# Altium schematic sheet Sheet1.SchDoc
size A4; SheetNumber: 1; SheetTotal: 1
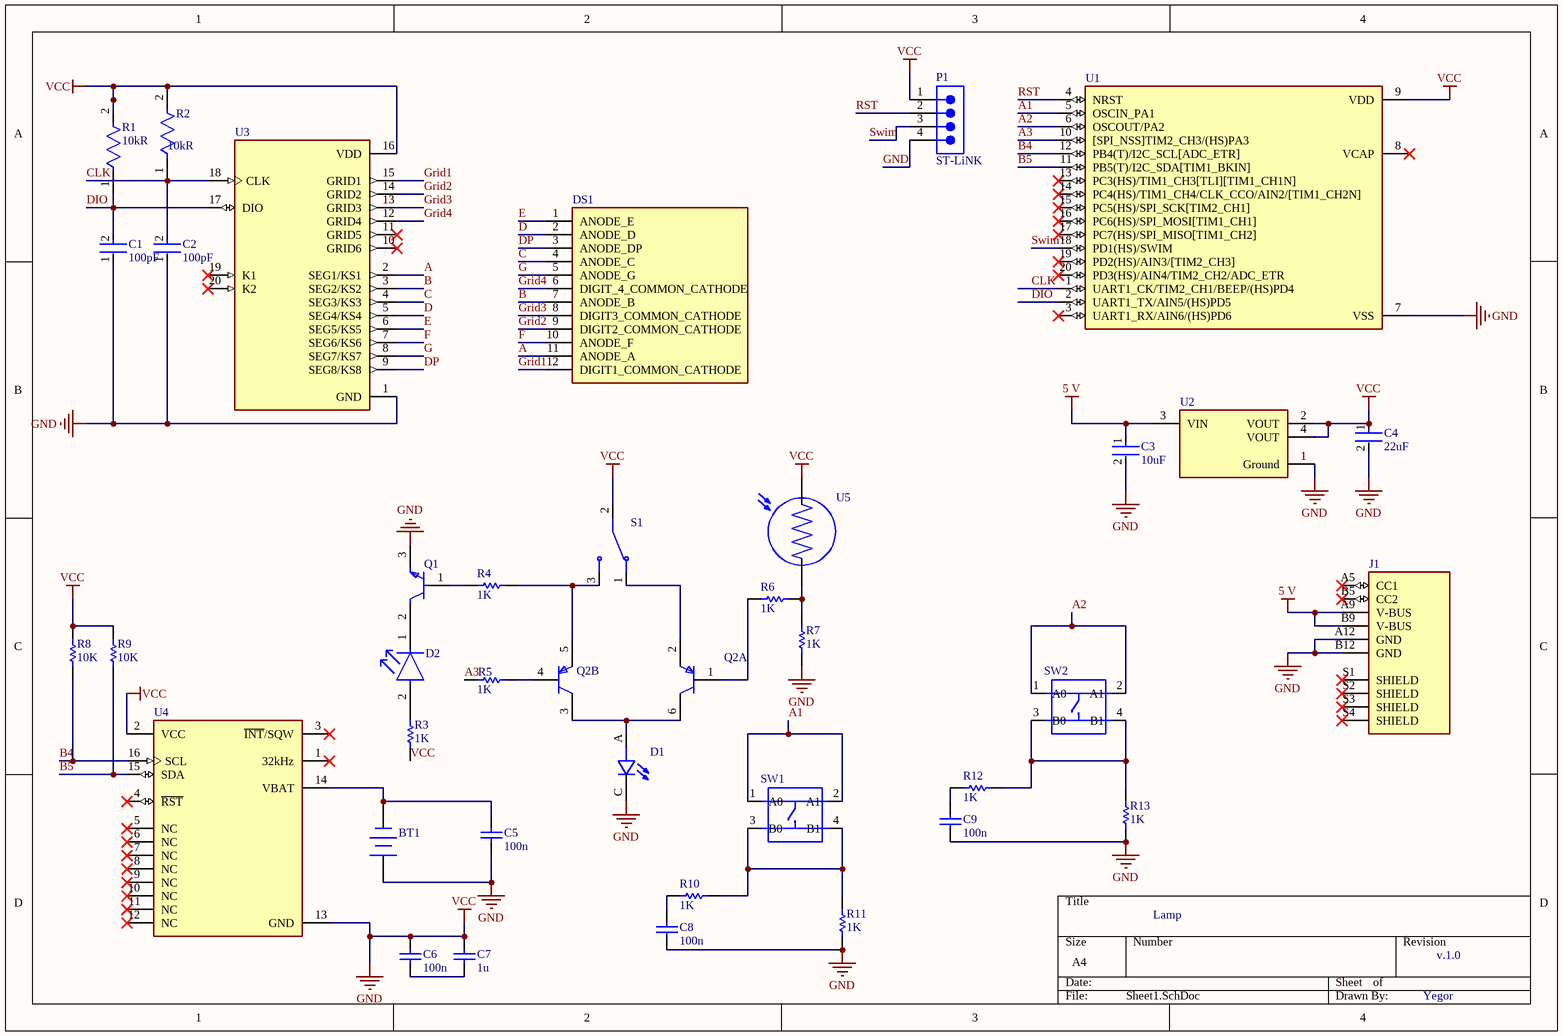
[diagram p0: Sheet1.SchDoc]

## Parts
BT1  (no value)  [PANA-CR-2032HFN]
C1  100pF  [FP-C1608-080-0_1-MFG]
C2  100pF  [FP-C1608-080-0_1-MFG]
C3  10uF  [FP-CL21-IPC_A]
C4  22uF  [FP-CL32-IPC_A]
C5  value 100n  (hidden comment: Capacitor)
C6  value 100n  (hidden comment: Capacitor)
C7  value 1u  (hidden comment: Capacitor)
C8  value 100n  (hidden comment: Capacitor)
C9  value 100n  (hidden comment: Capacitor)
D1  (no value)  [LEDC1608X65N]
D2  (no value)  [FP-6_541-5092_01-4-MFG]
DS1  (no value)  [AVAGO_HDSP-B09G]
J1  (no value)  [CUI_UJC-HP-3-SMT-TR]
P1  ST-LiNK  [61300411021]
Q1  (no value)  [PLZZ0004CA-A_MFG]
Q2  (no value)  [SOT95P280X145-6_P6_064_N]  (parts A,B of 2)
R1  10kR  [FP-CRCW1206-e3-IPC_B]
R2  10kR  [FP-CRCW1206-e3-IPC_B]
R3  value 1K  (hidden comment: Resistor)
R4  value 1K  (hidden comment: Resistor)
R5  value 1K  (hidden comment: Resistor)
R6  value 1K  (hidden comment: Resistor)
R7  value 1K  (hidden comment: Resistor)
R8  value 10K  (hidden comment: Resistor)
R9  value 10K  (hidden comment: Resistor)
R10  value 1K  (hidden comment: Resistor)
R11  value 1K  (hidden comment: Resistor)
R12  value 1K  (hidden comment: Resistor)
R13  value 1K  (hidden comment: Resistor)
S1  (no value)  [SW_MINI-SPDT-SW]
SW1  (no value)  [SW4-SMD-5.2X5.2X1.5MM]
SW2  (no value)  [SW4-SMD-5.2X5.2X1.5MM]
U1  (no value)  [SOP65P640X120-20N]
U2  (no value)  [FP-AMS1117-IPC_A]
U3  (no value)  [DIP778W43P254L2612H431Q20N]
U4  (no value)  [FP-W16-H2-MFG]
U5  (no value)  [XDCR_PDV-P8003]

## Nets
5 V: C3.1 J1.A9(V-BUS) J1.B9(V-BUS) U2.3(VIN)
GND: BT1.1(+) C1.1 C2.1 C3.2 C4.1 C4.2 C5.1 C6.2 C7.2 C8.1 C9.1 D1.C J1.A12(GND) J1.B12(GND) P1.1 P1.4 Q1.3(EMITTER) R1.2 R2.2 R3.1 R7.1 R8.2 R9.2 R11.1 R13.1 S1.2 U1.7(VSS) U1.9(VDD) U2.1(Ground) U2.2(VOUT) U2.4(VOUT) U3.1(GND) U3.16(VDD) U4.2(VCC) U4.13(GND) U5.2  [also labelled VCC]
A: DS1.11(ANODE_A) U3.2(SEG1/KS1)
A1: SW1.1(A0) SW1.2(A1) U1.5(OSCIN_PA1)
A2: SW2.1(A0) SW2.2(A1) U1.6(OSCOUT/PA2)
A3: R5.2 U1.10([SPI_NSS]TIM2_CH3/(HS)PA3)
B: DS1.7(ANODE_B) U3.3(SEG2/KS2)
B4: R8.1 U1.12(PB4(T)/I2C_SCL[ADC_ETR]) U4.16(SCL)
B5: R9.1 U1.11(PB5(T)/I2C_SDA[TIM1_BKIN]) U4.15(SDA)
C: DS1.4(ANODE_C) U3.4(SEG3/KS3)
CLK: C2.2 R2.1 U1.1(UART1_CK/TIM2_CH1/BEEP/(HS)PD4) U3.18(CLK)
D: DS1.2(ANODE_D) U3.5(SEG4/KS4)
DIO: C1.2 R1.1 U1.2(UART1_TX/AIN5/(HS)PD5) U3.17(DIO)
DP: DS1.3(ANODE_DP) U3.9(SEG8/KS8)
E: DS1.1(ANODE_E) U3.6(SEG5/KS5)
F: DS1.10(ANODE_F) U3.7(SEG6/KS6)
G: DS1.5(ANODE_G) U3.8(SEG7/KS7)
Grid1: DS1.12(DIGIT1_COMMON_CATHODE) U3.15(GRID1)
Grid2: DS1.9(DIGIT2_COMMON_CATHODE) U3.14(GRID2)
Grid3: DS1.8(DIGIT3_COMMON_CATHODE) U3.13(GRID3)
Grid4: DS1.6(DIGIT_4_COMMON_CATHODE) U3.12(GRID4)
RST: P1.2 U1.4(NRST)
Swim: P1.3 U1.18(PD1(HS)/SWIM)
NetBT1_2: BT1.2(-) C5.2 U4.14(VBAT)
NetC6_1: C6.1 C7.1
NetC8_2: C8.2 R10.1
NetC9_2: C9.2 R12.1
NetD1_A: D1.A Q2.3(2_COLLECTOR) Q2.6(1_COLLECTOR)
NetD2_1: D2.1(C) Q1.2(COLLECTOR)
NetD2_2: D2.2(A) R3.2
NetQ1_1: Q1.1(BASE) R4.1
NetQ2_1: Q2.1(1_BASE) R6.1
NetQ2_2: Q2.2(1_EMITTER) S1.1
NetQ2_4: Q2.4(2_BASE) R5.1
NetQ2_5: Q2.5(2_EMITTER) R4.2 S1.3
NetR6_2: R6.2 R7.2 U5.1
NetR10_2: R10.2 R11.2 SW1.3(B0) SW1.4(B1)
NetR12_2: R12.2 R13.2 SW2.3(B0) SW2.4(B1)

Not connected (* = marked no-connect by the designer): J1 A5(CC1)* B5(CC2)* S1(SHIELD)* S2(SHIELD)* S3(SHIELD)* S4(SHIELD)*; U1 3(UART1_RX/AIN6/(HS)PD6)* 8(VCAP)* 13(PC3(HS)/TIM1_CH3[TLI][TIM1_CH1N])* 14(PC4(HS)/TIM1_CH4/CLK_CCO/AIN2/[TIM1_CH2N])* 15(PC5(HS)/SPI_SCK[TIM2_CH1])* 16(PC6(HS)/SPI_MOSI[TIM1_CH1])* 17(PC7(HS)/SPI_MISO[TIM1_CH2])* 19(PD2(HS)/AIN3/[TIM2_CH3])* 20(PD3(HS)/AIN4/TIM2_CH2/ADC_ETR)*; U3 10(GRID6)* 11(GRID5)* 19(K1)* 20(K2)*; U4 1(32kHz)* 3(~{INT}/SQW)* 4(~{RST})* 5(NC)* 6(NC)* 7(NC)* 8(NC)* 9(NC)* 10(NC)* 11(NC)* 12(NC)*

## Notes on the sheet
- Lamp
- v.1.0
- Yegor

## Library data of the parts
BT1 = CMP-2000-05296-1: Coin Cell Battery, 225 mAh, 0.2 mA, 3 V, -30 to 60 degC, Bulk; Manufacturer: Panasonic; SVHC: 1,2-dimethoxyethane,ethyleneglycoldimethylether(EGDME)(15-Jun-2015); Battery Size Code: 2032; Battery Voltage: 3V; Battery IEC Code: CR2032; Battery NEDA Code: 5004LC; External Height: 3.2mm; Battery Terminals: PCBPins; Battery Capacity: 220mAh; External Diameter: 20mm; Battery Technology: LithiumManganeseDioxide; Product Range: -; Datasheet Version: Rev. 0, 05/2010; Manufacturer URL: http://www.panasonic.com/; External Depth: -; Weight: 2.9g; Datasheet URL: https://datasheet.ciiva.com/3/aaa4000de87-3072.pdf; External Width: -
C1 C2 = CMP-08246-002637-1: Multilayer Ceramic Capacitors 100pF ±5% 50V C0G SMD 0603; Temperature Coefficient: 30ppm/°C; Dielectric Material: Ceramic; Width: 0.031inch; Case/Package: 0603; Package Quantity: 1; REACH SVHC: No SVHC; Depth: 0.8mm; Height: 0.8mm; Thickness: 0.037inch; Capacitance: 100pF; Min Operating Temperature: -55°C; Packaging: Tape and Reel; Case Code (Metric): 1608; Lead Free: Lead Free; Length: 1.6mm; Voltage: 50V; Dielectric: C0G; Tolerance: 5%; Weight: 7.1E-05oz; Voltage Rating (DC): 50V; Mount: Surface Mount; Termination: SMD/SMT; Voltage Rating: 50V; Series: C; Radiation Hardening: No; Number of Pins: 2; Max Operating Temperature: 125°C; Construction: Flat; RoHS Compliant: Yes; Case Code (Imperial): 0603
C3 = CMP-13271-002245-1: CL21 Series 0805 10uF 10V ±20% Tolerance X5R Multilayer Ceramic Chip Capacitor; Voltage Rating (DC): 10V; Mount: Surface Mount; Tolerance: 20%; Case/Package: 0805; Voltage Rating: 10V; Dielectric: X5R; Max Operating Temperature: 85°C; Packaging: Tape and Reel; Capacitance: 10uF; Height: 1.25mm; Thickness: 0.053inch; Width: 0.049inch; Length: 2mm; Radiation Hardening: No; Min Operating Temperature: -55°C; Depth: 1.25mm; Package Quantity: 10000
C4 = CMP-13271-001877-1: Cap Ceramic 22uF 6.3V X7R ±20% SMD 1210 +125°C Embossed T/R; Radiation Hardening: No; Case Code (Metric): 3225; Tolerance: 20%; Dielectric: X7R; Voltage Rating (DC): 6.3V; Package Quantity: 1; Lead Free: Lead Free; Max Operating Temperature: 125°C; Height: 2.5mm; Thickness: 0.106inch; Case Code (Imperial): 1210; Voltage Rating: 6.3V; Packaging: Tape and Reel; Capacitance: 22uF; Length: 3.2mm; Min Operating Temperature: -55°C; Depth: 2.5mm; Case/Package: 1210; Width: 0.098inch; Mount: Surface Mount
C5-C9 = Capacitor: SimulationGenericComponent: True
D1 = LTW-C191TLA: CHIP LED WHITE 0603 TOP VIEW; Package: None; Availability: Unavailable; MP: LTW-C191TLA; Value: *; Price: None
D2 = CMP-02520-000012-1: LED RED 0603 SMD; Manufacturer: Vishay; Manufacturer Part Number: VLMS1300-GS08; Forward Voltage: 2V; Reverse Voltage: 5V; Power Dissipation: 75mW; Forward Current: 20mA; Luminous Intensity: 54mcd; Led Orientation: Top View; Peak Emmision Wavelength: 639nm; Viewing Angle: 130°; Wavelength: 631nm; Digikey Description: LED RED 0603 SMD; Height: 1mm; Colour: Red; Ambient Temperature Range High: +85°C; Ambient Temperature Range Low: -35°C; Package: 6.541-5092.01-4; Automotive: No; Temperature Range High: +85°C; Device Class L3: unset; Lead Free: Yes; Temperature Range Low: -35°C; Temperature: -35°C to +85°C; Device Class L2: LEDs; ComponentLink2Description: Datasheet; Octopart: https://octopart.com/vlms1300-gs08-vishay-21709201; Device Class L1: Optoelectronics; RoHS: TRUE; ComponentLink2URL: http://www.vishay.com/docs/82437/vlmo1300.pdf; Mouser Description: Standard LEDs - SMD Super Red Clear Non-Diff; Category: Diode
DS1 = HDSP-B09G: Display Modules - LED Character and Numeric Green 7-Segment Clock 4 Character Common Cathode 2.2V 20mA 0.752 H x 2.016 W x 0.315 D (19.10mm x 51.20mm x 8.00mm) 12-DIP (0.600, 15.24mm); MF: Broadcom / Avago; SnapEDA_Link: https://www.snapeda.com/parts/HDSP-B09G/Broadcom/view-part/?ref=snap; Package: None; Value: *; MP: HDSP-B09G; Check_prices: https://www.snapeda.com/parts/HDSP-B09G/Broadcom/view-part/?ref=eda
J1 = UJC-HP-3-SMT-TR: Package: None; Price: None; Value: *; MP: UJC-HP-3-SMT-TR; Availability: Unavailable
P1 = CMP-1502-01063-3: NexarPartId: 31153320; Current Rating: 3A; Number of Contacts: 4; Gender: Male; Operating Supply Voltage: 250V; Contact Resistance: 20mΩ; Connector Type: Male Pin; Pitch: 2.54mm; Contact Material: Copper; Number of Positions: 4; Color: Black; Contact Plating: Gold; Number of Pins: 4; Termination: Solder; Number of Rows: 1; Lead Pitch: 2.54mm; Mount: Through Hole; Contact Mating Length: 5.9944mm; RoHS: Compliant; REACH SVHC: Unknown
Q1 = CMP-00572-18697870-1: Trans GP BJT NPN 50V 1A 4-Pin(3+Tab) UPAK T/R; Manufacturer Lifecycle Status: OBSOLETE; Number of Elements: 1; Collector Base Voltage (VCBO): 100V; Frequency: 100MHz; Emitter Base Voltage (VEBO): 6V; Power Dissipation: 1W; Lead Free: Lead Free; ComponentLink1Description: Manufacturer's Website; Max Operating Temperature: 150°C; ComponentLink3URL: https://www.renesas.com/en/document/psc/package-drawing-upak-4pin-plzz0004ca; ComponentLink1URL: http://www.renesas.com; Number of Pins: 4; Min Operating Temperature: -55°C; HelpURL: https://octopart.com/cad-content/api/get-model-datasheet/15189/18697870; RoHS: Compliant; Height: 1.6mm; Lifecycle Status: Obsolete; ComponentLink2URL: https://octopart.com/cad-content/api/get-model-datasheet/15189/18697870; Radiation Hardening: No; Collector Emitter Voltage (VCEO): 50V; ComponentLink2Description: Datasheet URL; Polarity: NPN; Mount: Through Hole; ComponentLink3Description: Manufacturer's Package Drawing; Packaging: Tape and Reel; China RoHS: Compliant
Q2 = CMP-00572-88253858-3: Transistor, Bjt, Pair, Pnp, 11V V(Br)Ceo, 14Ma I(C), So; Manufacturer Lifecycle Status: ACTIVE; Frequency: 7GHz; Max Collector Current: 26mA; Emitter Base Voltage (VEBO): 4.5V; Collector Base Voltage (VCBO): 12V; Element Configuration: Dual; Collector Emitter Breakdown Voltage: 9V; Noise Figure: 2.6dB; Pitch: 1mm; ComponentLink3URL: https://www.renesas.com/en/document/psc/package-drawing-sot23-6pin-p6064; Height: 0m; HelpURL: https://octopart.com/cad-content/api/get-model-datasheet/15189/88253858; Lifecycle Status: Production; Length: 2.9mm; RoHS: Compliant; Current Rating: 14mA; ComponentLink1URL: http://www.renesas.com; ComponentLink2URL: https://octopart.com/cad-content/api/get-model-datasheet/15189/88253858; Max Frequency: 7GHz; Transition Frequency: 7GHz; Schedule B: 8542330000; Case/Package: SOT-23-6; Export Control Classification Number (ECCN) Code: EAR99; Lead Free: Lead Free; Number of Pins: 6; Continuous Collector Current: 26mA; Min Operating Temperature: -40°C; ComponentLink2Description: Datasheet URL; Polarity: PNP; Voltage Rating (DC): 11V; Width: 1.7mm; ComponentLink1Description: Manufacturer's Website; ComponentLink3Description: Manufacturer's Package Drawing; Max Operating Temperature: 85°C; Radiation Hardening: No; Mount: Surface Mount; Gain Bandwidth Product: 7GHz; Collector Emitter Voltage (VCEO): 11V
R1 R2 = CMP-2003-04807-2: RES Thick Film, 10kΩ, 1%, 0.25W, 100ppm/°C, 1206; Working Voltage: 200V; Max Power Dissipation: 250mW; Tolerance: 1%; Width: 0.063inch; Height: 0.55mm; Number of Pins: 2; Voltage Rating: 200V; Resistance: 10kR; Temperature Coefficient: 100ppm/°C; Military Standard: Not; Features: Automotive AEC-Q200; Depth: 1.6mm; Radiation Hardening: No; Termination: SMD/SMT; Case Code (Imperial): 1206; Weight: 0.000353oz; Length: 3.2mm; Package Quantity: 10; Voltage Rating (DC): 200V; Case/Package: 1206; Min Operating Temperature: -55°C; Number of Terminations: 2; Composition: Thick Film; Contact Plating: Tin; Power Rating: 250mW; Packaging: Tape and Reel; Max Operating Temperature: 155°C; Lead Free: Lead Free; Case Code (Metric): 3216
R3-R13 = Resistor: TC1: 0; SimulationGenericComponent: True; TC2: 0
S1 = MINI-SPDT-SW: Simple breadboard friendly SPDT slide switch. Rated at 30V/200mA with operating force of 250 +/-100gf.; Availability: Unavailable; Package: None; MP: MINI-SPDT-SW; Value: *; Price: None
SW1 SW2 = SMD-BUTTON(4P-5.2X5.2X1.5MM-SKQGAKE010): Switch Tactile N.O. SPST Button Gull Wing 0.05A 12VDC 3.43N SMD T/R; MF: ALPS; SnapEDA_Link: https://www.snapeda.com/parts/SKQGAKE010/ALPS/view-part/51324/?ref=snap; MP: SKQGAKE010; Price: None; Package: None; Value: *; Availability: Unavailable
U1 = STM8S103F3P6: STM8 series Microcontroller IC 8-Bit 16MHz 8KB (8K x 8) FLASH 20-TSSOP; MF: STMicroelectronics; SnapEDA_Link: https://www.snapeda.com/parts/STM8S103F3P6/STMicroelectronics/view-part/?ref=snap; Package: TSSOP-20 STMicroelectronics; Value: *; MP: STM8S103F3P6; Check_prices: https://www.snapeda.com/parts/STM8S103F3P6/STMicroelectronics/view-part/?ref=eda
U2 = CMP-209535-000001-1: LDO Voltage Regulators 1A, 3.3V; Manufacturer Part Number: AMS1117-3.3; Manufacturer: Advanced Monolithic Systems; Dropout Voltage: 1.1V; Output Type: Fixed; Nominal Supply Current: 5mA; Max Power Dissipation: 1.2W; Max Supply Voltage: 15V; Number Of Outputs: 1; Standoff Height: 0.64mm; Max Junction Temp: +125°C; Height: 1.8mm; Package: AMS1117; Device Class L2: Power Management ICs; ComponentLink2Description: Datasheet; ComponentLink2URL: http://www.advanced-monolithic.com/pdf/ds1117.pdf; Category: IC; RoHS: TRUE; Automotive: No; Device Class L1: Integrated Circuits (ICs); Output Current: 1A; Device Class L3: Voltage Regulators - Linear; Temperature: -40°C to +125°C; Output Voltage: 3.3V; Temperature Range Low: -40°C; Octopart: https://octopart.com/ams1117-3.3-advanced+monolithic+systems-25899300; Lead Free: Yes; Ipc Land Pattern Name: SOT229P700X180-4; Temperature Range High: +125°C
U3 = TM1637: LED Drive Control Special Circuit; MF: Titan Micro Electronics; SnapEDA_Link: https://www.snapeda.com/parts/TM1637/Titan+Micro+Electronics/view-part/?ref=snap; Package: None; Value: *; MP: TM1637; Check_prices: https://www.snapeda.com/parts/TM1637/Titan+Micro+Electronics/view-part/?ref=eda
U4 = CMP-0254-00375-2: IC RTC CLK/CALENDAR I2C 16-SOIC; Operating Supply Voltage: 3.3V; Max Supply Voltage: 5.5V; Logic Function: Clock; Time Format: HH:MM:SS; Date Format: YY-MM-DD-dd; Min Supply Voltage: 2.3V; Min Operating Temperature: -40°C; Packaging: Tape and Reel; Radiation Hardening: No; Package Quantity: 1000; Case/Package: SOIC; Max Operating Temperature: 85°C; Lead Free: Lead Free; Interface: I2C; Contact Plating: Tin; Number of Pins: 16; Mount: Surface Mount
U5 = PDV-P8003: CdS Cells 520nm 16 ~ 33kOhms @ 10 lux; MF: Advanced Photonix; SnapEDA_Link: https://www.snapeda.com/parts/PDV-P8003/Advanced+Photonix/view-part/?ref=snap; Package: Radial Advanced Photonix; Value: *; MP: PDV-P8003; Check_prices: https://www.snapeda.com/parts/PDV-P8003/Advanced+Photonix/view-part/?ref=eda